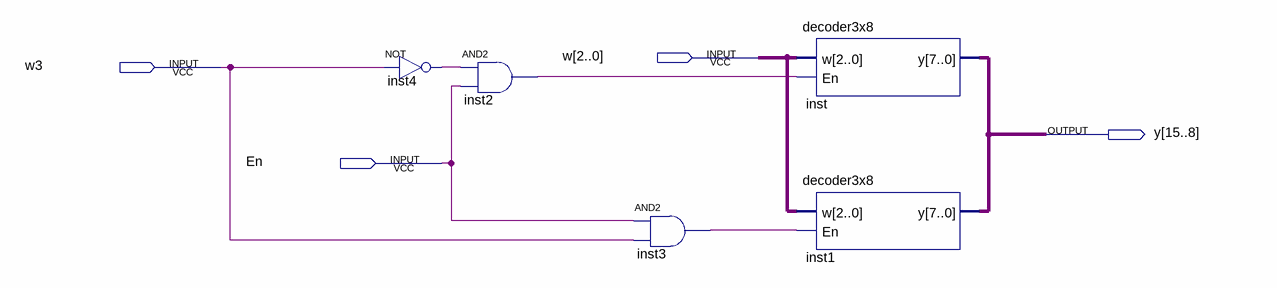
[diagram p0: schematic sheet]
// Quartus schematic 4x16decod.bdf as structural Verilog: 5 symbols, 4 pins
module \4x16decod  (
  input  [2:0] w,
  input  w3,
  input  En,
  output [15:8] y
);

  wire inst2_out, inst3_out, inst4_out;

  not inst4 (inst4_out, w3);
  and inst2 (inst2_out, inst4_out, En);
  and inst3 (inst3_out, En, w3);
  decoder3x8 inst (.w(w), .En(inst2_out), .y(y));
  decoder3x8 inst1 (.w(w), .En(inst3_out), .y(y));
endmodule
